# EAGLE design EXM HMI LED - Rev A1 (EAGLE 7.7.0)
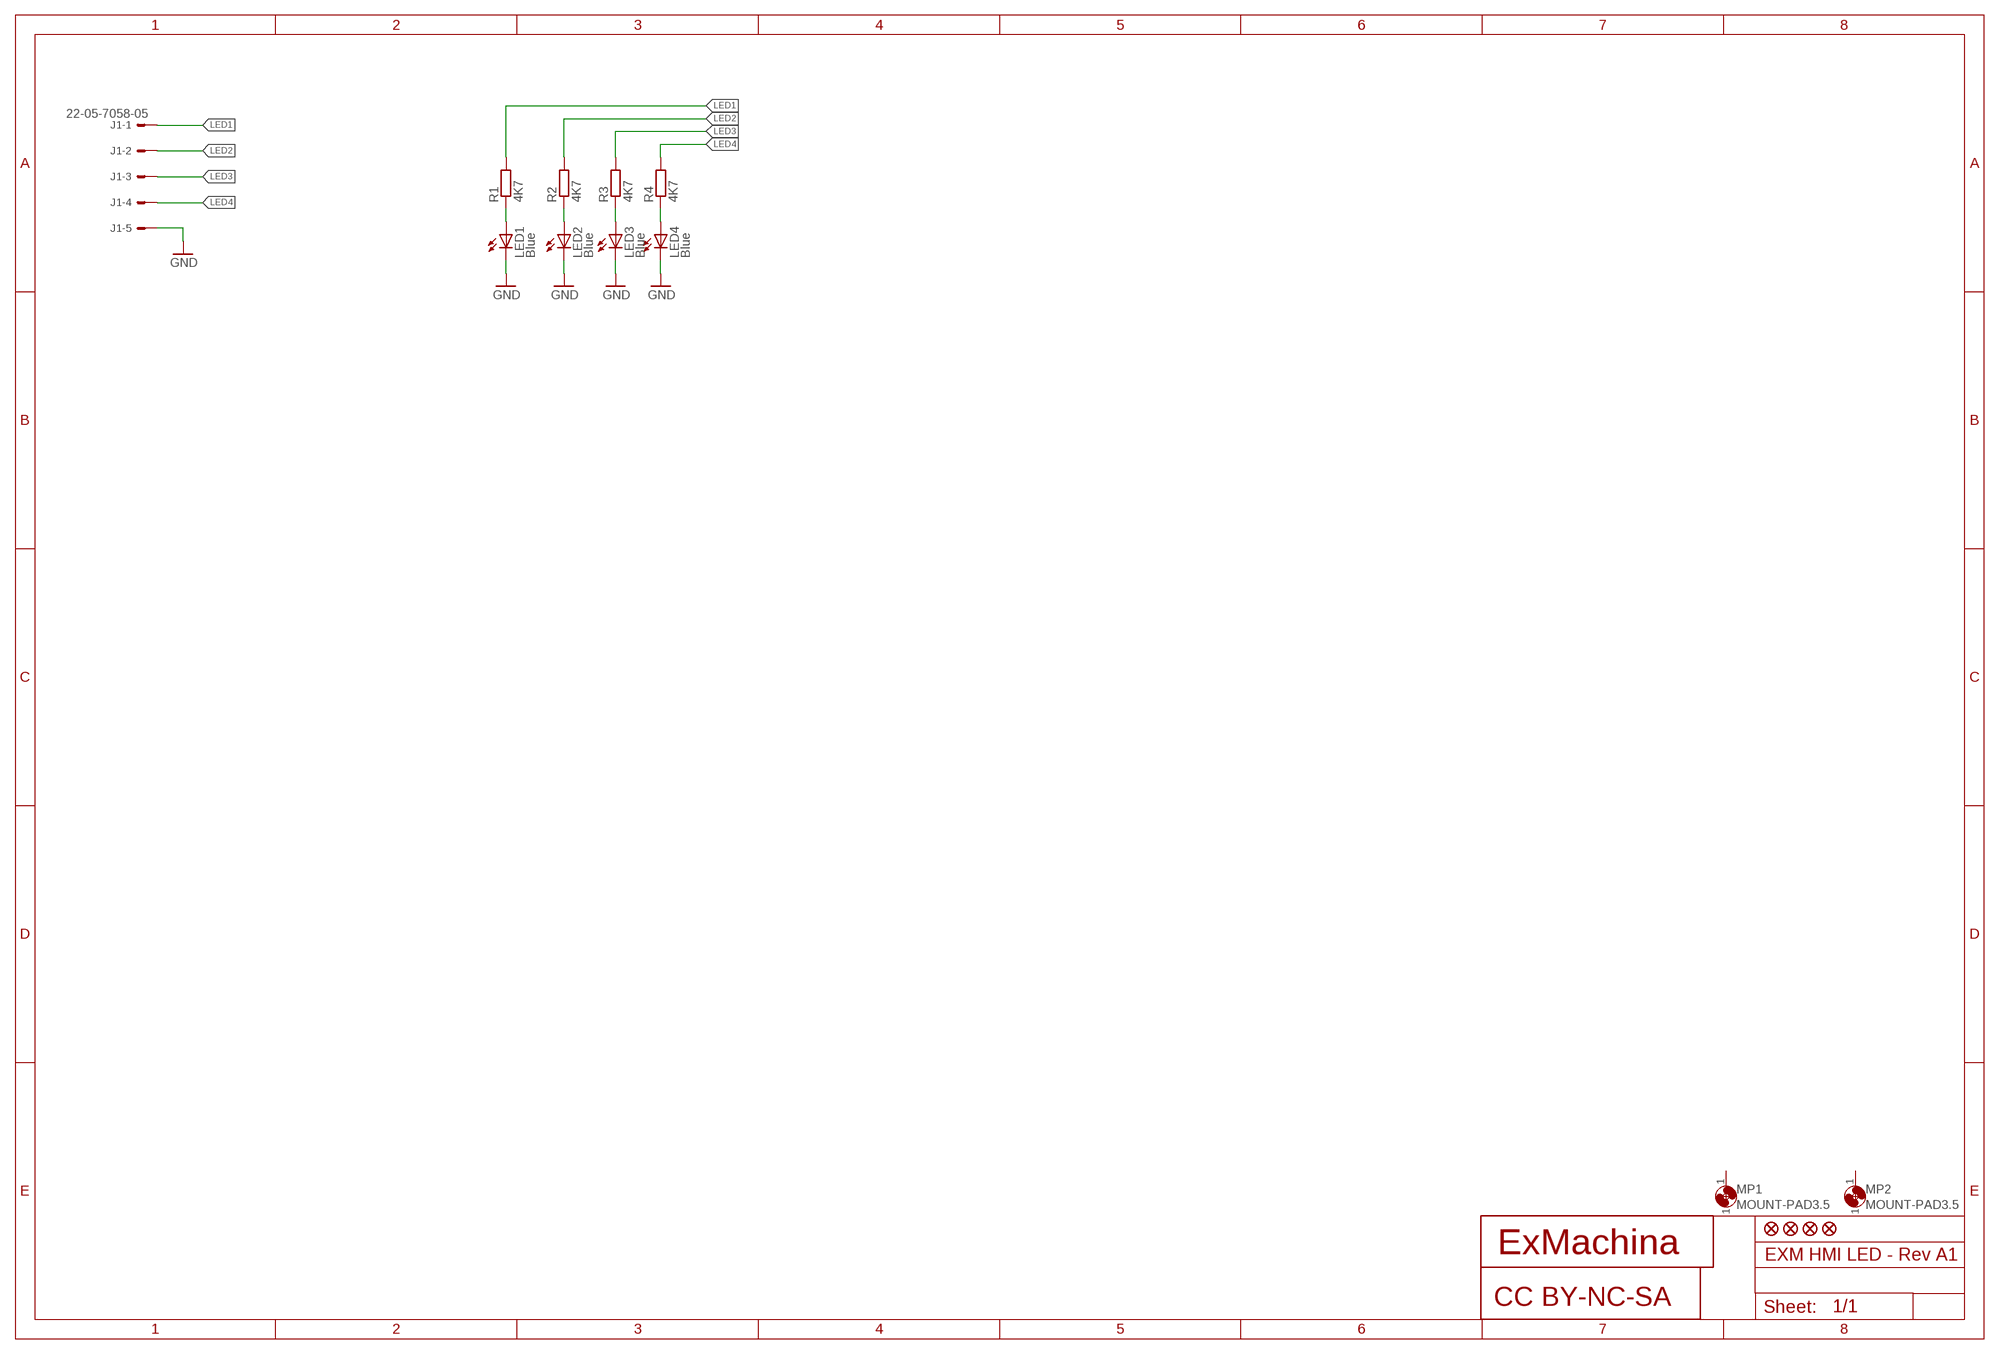
[diagram p0: schematic, sheet 1]

## Parts
CC1  CC-BY-NC-SA  [CC-BY-NC-SA]
J1  22-05-7058-05  [7395-05]
JP1  FIDUCIAL1X2  [FIDUCIAL-1X2]
JP2  FIDUCIAL1X2  [FIDUCIAL-1X2]
JP3  FIDUCIAL1X2  [FIDUCIAL-1X2]
JP4  FIDUCIAL1X2  [FIDUCIAL-1X2]
LED1  Blue  LEDCHIP-LED0603  [CHIP-LED0603]
LED2  Blue  LEDCHIP-LED0603  [CHIP-LED0603]
LED3  Blue  LEDCHIP-LED0603  [CHIP-LED0603]
LED4  Blue  LEDCHIP-LED0603  [CHIP-LED0603]
MP1  MOUNT-PAD3.5  [P3,5]
MP2  MOUNT-PAD3.5  [P3,5]
R1  4K7  R-EU_R0603  [R0603]
R2  4K7  R-EU_R0603  [R0603]
R3  4K7  R-EU_R0603  [R0603]
R4  4K7  R-EU_R0603  [R0603]
T1  EXMACHINA-LOGO-NAME  [EXM-LOGO-BASELINE]

## Nets
GND: J1.5 LED1.C LED2.C LED3.C LED4.C
LED1: J1.1 R1.2
LED2: J1.2 R2.2
LED3: J1.3 R3.2
LED4: J1.4 R4.2
N$1: LED4.A R4.1
N$2: LED3.A R3.1
N$3: LED2.A R2.1
N$4: LED1.A R1.1
Unconnected: MP1.1 MP2.1

## Library data of the parts
CC1 = cc-by-sa:CC-BY-NC-SA
J1 = con-molex:22-?-05: CONNECTOR wire to board 2.54 mm (.1 inch) pitch header; OC_FARNELL: unknown; OC_NEWARK: unknown
JP1-JP4 = SparkFun:FIDUCIAL: Fiducial Alignment Points Various fiducial points for machine vision alignment.
LED1-LED4 = led:LED: LED OSRAM: - CHIPLED LG R971, LG N971, LY N971, LG Q971, LY Q971, LO R971, LY R971 LH N974, LH R974 LS Q976, LO Q976, LY Q976 LO Q996 - Hyper CHIPLED LW Q18S LB Q993, LB Q99A, LB R99A - SideLED LS A670, LO A670, LY A670, LG A670, LP A670 LB A673, LV A673, LT A673, LW A673 LH A674 LY A675 LS A676, LA A676, LO A676, LY A676, LW A676 LS A679, LY A679, LG A679 - Hyper Micro SIDELED® LS Y876, LA Y876, LO Y876, LY Y876 LT Y87S - SmartLED LW L88C, LW L88S LB L89C, LB L89S, LG L890 LS L89K, LO L89K, LY L89K LS L896, LA L896, LO L896, LY L896 - TOPLED LS T670, LO T670, LY T670, LG T670, LP T670 LSG T670, LSP T670, LSY T670, LOP T670, LYG T670 LG T671, LOG T671, LSG T671 LB T673, LV T673, LT T673, LW T673 LH T674 LS T676, LA T676, LO T676, LY T676, LB T676, LH T676, LSB T676, LW T676 LB T67C, LV T67C, LT T67C, LS T67K, LO T67K, LY T67K, LW E67C LS E67B, LA E67B, LO E67B, LY E67B, LB E67C, LV E67C, LT E67C LW T67C LS T679, LY T679, LG T679 LS T770, LO T770, LY T770, LG T770, LP T770 LB T773, LV T773, LT T773, LW T773 LH T774 LS E675, LA E675, LY E675, LS T675 LS T776, LA T776, LO T776, LY T776, LB T776 LHGB T686 LT T68C, LB T68C - Hyper Mini TOPLED® LB M676 - Mini TOPLED Santana® LG M470 LS M47K, LO M47K, LY M47K Source: http://www.osram.convergy.de LUXEON: - LUMILED® LXK2-PW12-R00, LXK2-PW12-S00, LXK2-PW14-U00, LXK2-PW14-V00 LXK2-PM12-R00, LXK2-PM12-S00, LXK2-PM14-U00 LXK2-PE12-Q00, LXK2-PE12-R00, LXK2-PE12-S00, LXK2-PE14-T00, LXK2-PE14-U00 LXK2-PB12-K00, LXK2-PB12-L00, LXK2-PB12-M00, LXK2-PB14-N00, LXK2-PB14-P00, LXK2-PB14-Q00 LXK2-PR12-L00, LXK2-PR12-M00, LXK2-PR14-Q00, LXK2-PR14-R00 LXK2-PD12-Q00, LXK2-PD12-R00, LXK2-PD12-S00 LXK2-PH12-R00, LXK2-PH12-S00 LXK2-PL12-P00, LXK2-PL12-Q00, LXK2-PL12-R00 Source: www.luxeon.com KINGBRIGHT: KA-3528ASYC Source: www.kingbright.com
MP1 MP2 = holes:MOUNT-PAD: MOUNTING HOLE with drill center marker
R1-R4 = rcl:R-EU_: RESISTOR, European symbol
T1 = exmachina:EXMACHINA-LOGO

## Board
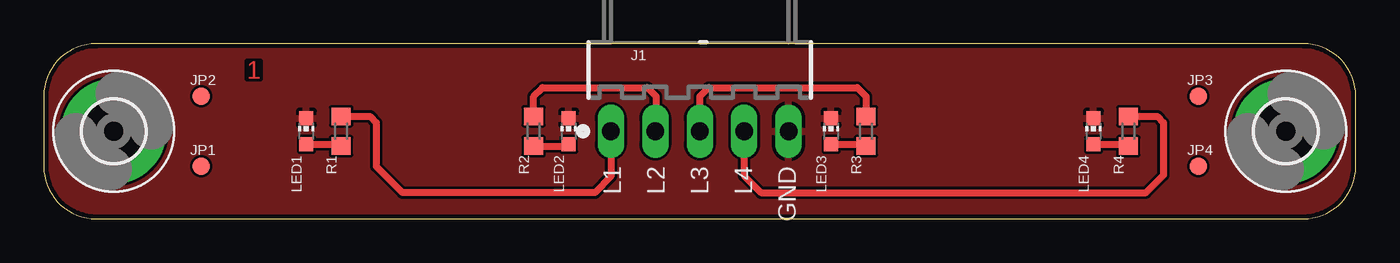
[diagram p1: board, top side]
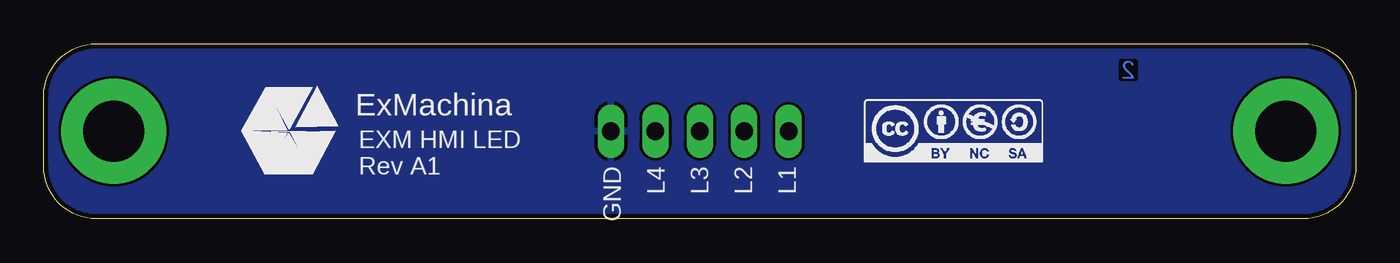
[diagram p2: board, bottom side, seen from below]

Size 75 x 10 mm. Coordinates in mm from the lower left corner, seen from the top.
Outline: 0,7 0,3 arc90 3,0 72,0 arc90 75,3 75,7 arc90 72,10 3,10 arc90 0,7
Copper layers (1*16): Top 0.018mm / dielectric 1.55mm / Bottom 0.018mm
Design rules "eC_2Layer_PClass6_BaseCopperO18_eCDefault": minimum track width 0.15mm, minimum drill 0.35mm, track to track 0.15mm, track to pad 0.15mm, pad to pad 0.15mm, via to via 0.15mm, smd to smd 0mil, copper to edge 0.25mm, drill to drill 0.35mm, minimum pad ring 0.175mm, minimum via ring 0.125mm, stop-mask expansion 0mil, vias tented up to drill 0.45mm, thermal gap 0.2mm

### Footprints (pad centres in the part's own frame; a part is rotated, then mirrored left to right if it is on the bottom)
7395-05 = drill 1.016 long: 1 5.08,0; 2 2.54,0; 3 0,0; 4 -2.54,0; 5 -5.08,0
FIDUCIAL-1X2 = smd 1 x 1: 1 0,0
CHIP-LED0603 = smd 0.8 x 0.8: A 0,-0.75; C 0,0.75
P3,5 = drill 3.5 pad 6: 1 0,0
R0603 = smd 1 x 1.1: 1 -0.85,0; 2 0.85,0

### Placement (x,y rotation side)
CC1  23,5 0 bottom
J1  37.5,5 180 top
JP1  9,3 0 top
JP2  9,7 0 top
JP3  66,7 0 top
JP4  66,3 0 top
LED1  15,5 0 top
LED2  30,5 0 top
LED3  45,5 0 top
LED4  60,5 0 top
MP1  71,5 0 top
MP2  4,5 0 top
R1  17,5 90 top
R2  28,5 90 top
R3  47,5 90 top
R4  62,5 90 top
T1  61,5 0 bottom
U$1  [A4L-LOC]  -87,-80 0 top  (outside the outline)

### Tracks (layer width: path | path; a pad name or v marks a point on that pad's centre or on a via)
GND
  pour Top: -3,13 -3,-3 78,-3 78,13
  pour Bottom: -2,12 77,12 77,-2 -2,-2
LED1
  Top 0.406: J1.1 32.42,2.42 31.5,1.5 20.5,1.5 19,3 19,5.5 18.65,5.85 R1.2
LED2
  Top 0.406: R2.2 28,7 28.5,7.5 34.5,7.5 35,7 35,4.04 J1.2
LED3
  Top 0.406: J1.3 37.5,7 38,7.5 46.5,7.5 47,7 R3.2
LED4
  Top 0.406: J1.4 40.04,2.46 41,1.5 63,1.5 64,2.5 64,5.5 63.65,5.85 R4.2
N$1
  Top 0.406: LED4.A 62,4.25 R4.1
N$2
  Top 0.406: LED3.A 47,4.25 R3.1
N$3
  Top 0.406: R2.1 30,4.15 LED2.A
N$4
  Top 0.406: LED1.A 17,4.25 R1.1

### Text on the board
Top: 1
Bottom: 2
tPlace: L1 | L2 | L3 | L4 | GND
bPlace: L1 | L2 | L3 | L4 | GND | EXM HMI LED / Rev A1